# EAGLE schematic Robotics Booster Pack Dual Motor Adapter (EAGLE 6.4)
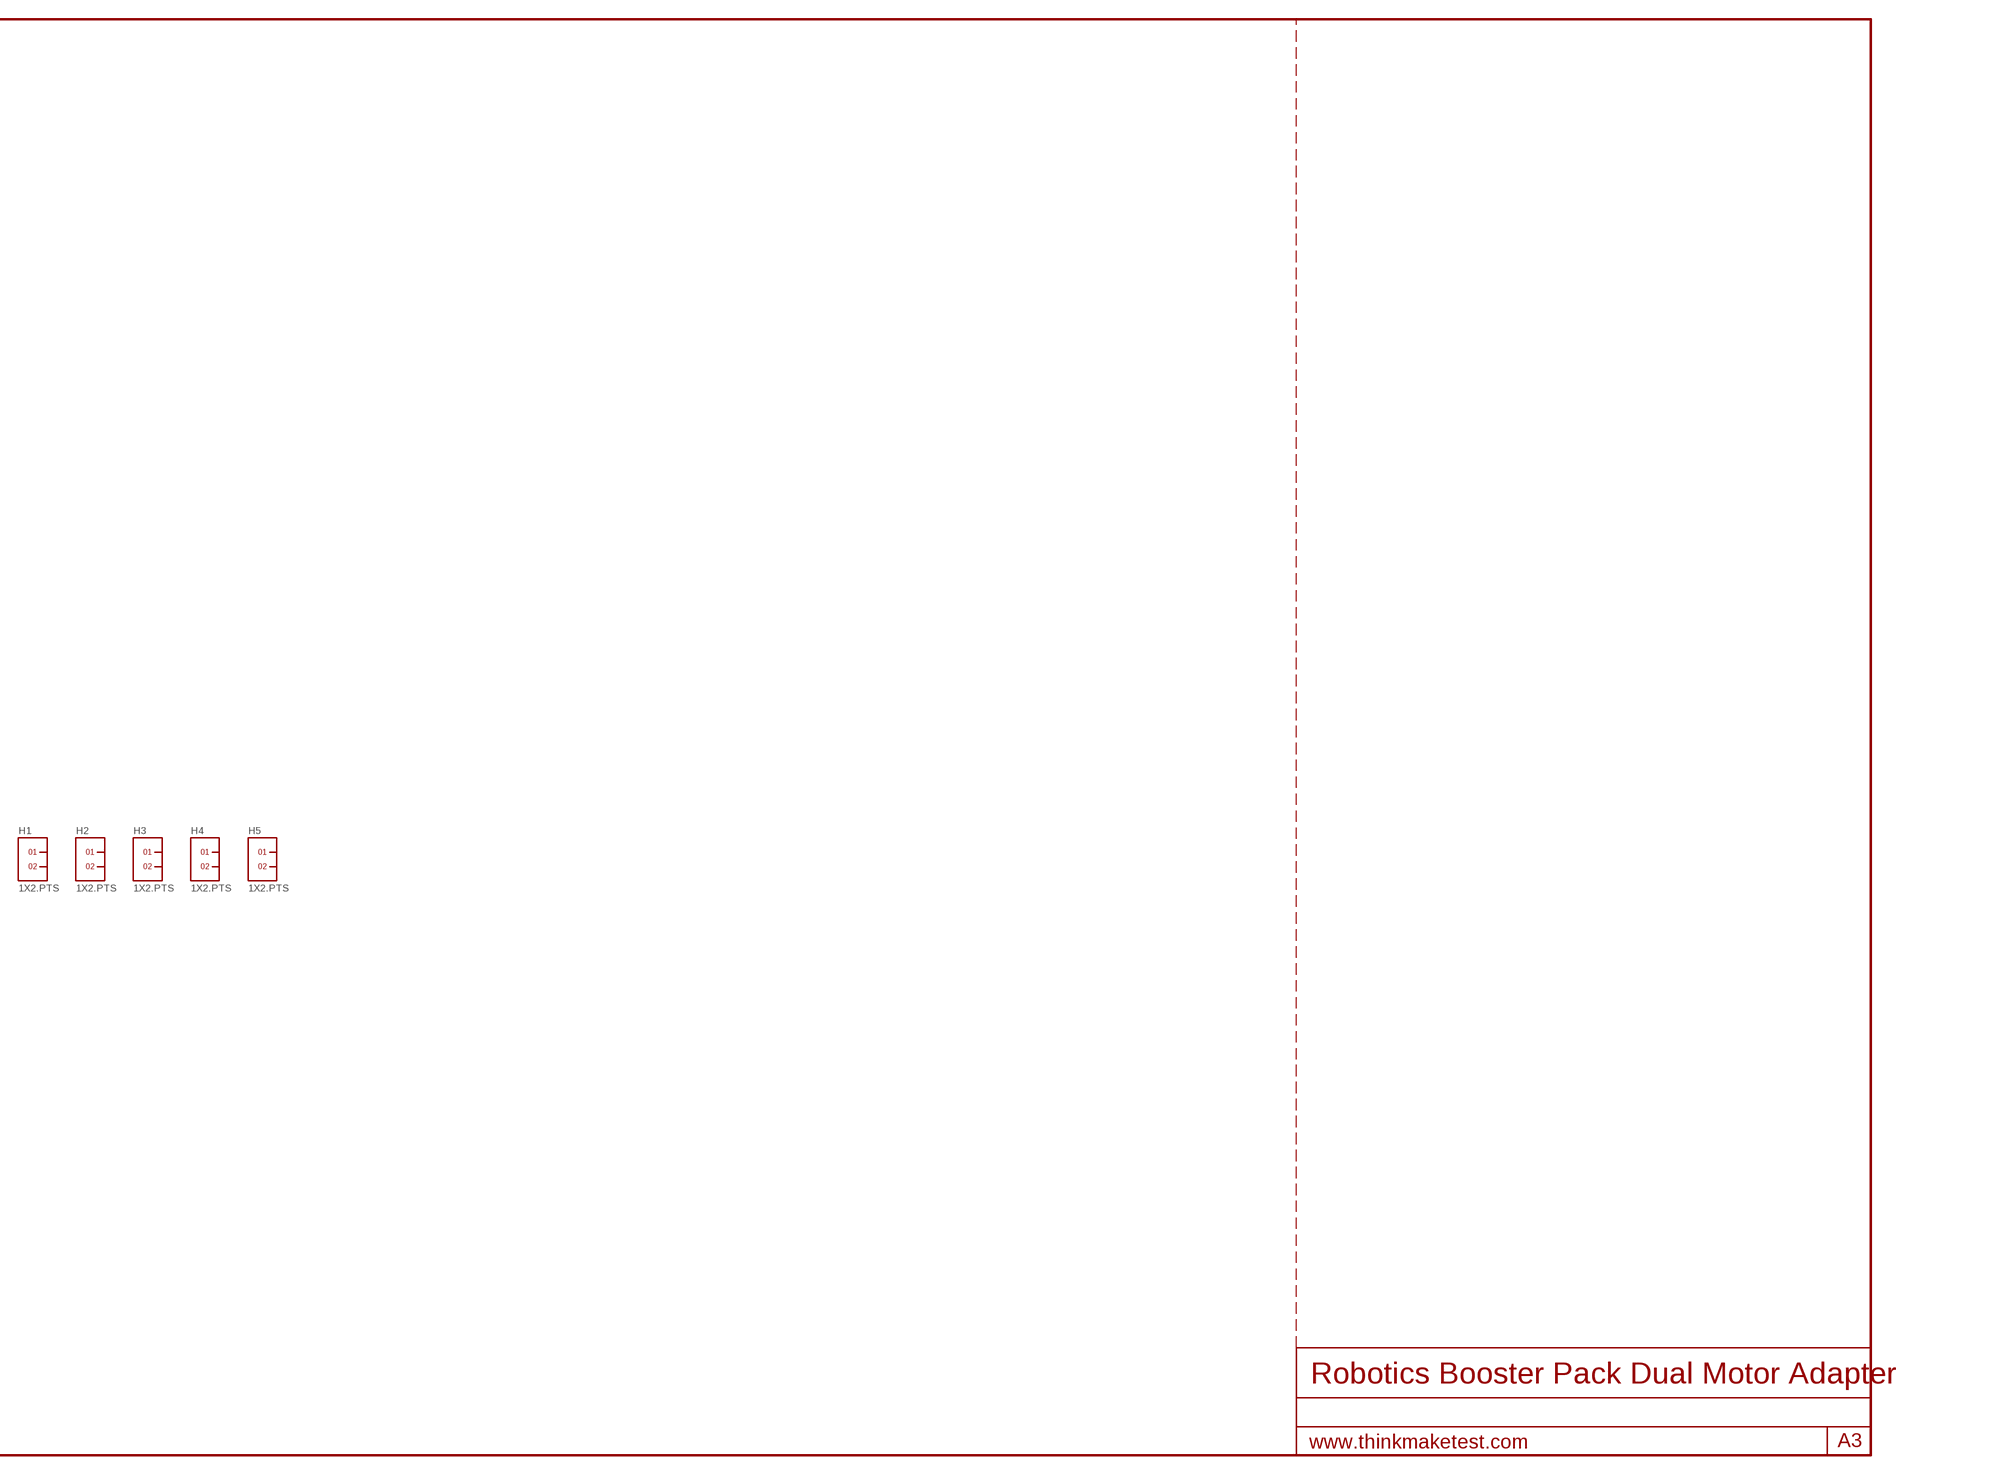
[diagram p0: schematic, sheet 1]

## Parts
H1  1X2.PTS  1X2.PTS.PLUG  [PTS.PLUG]
H2  1X2.PTS  1X2.PTS.PLUG  [PTS.PLUG]
H3  1X2.PTS  1X2.PTS.PLUG  [PTS.PLUG]
H4  1X2.PTS  1X2.PTS.PLUG  [PTS.PLUG]
H5  1X2.PTS  1X2.PTS.PLUG  [PTS.PLUG]
Unconnected: H1.1 H1.2 H2.1 H2.2 H3.1 H3.2 H4.1 H4.2 H5.1 H5.2

## Library data of the parts
H1-H5 = phoenixcontact:1X2